# EAGLE design counter (EAGLE 8.3.2)
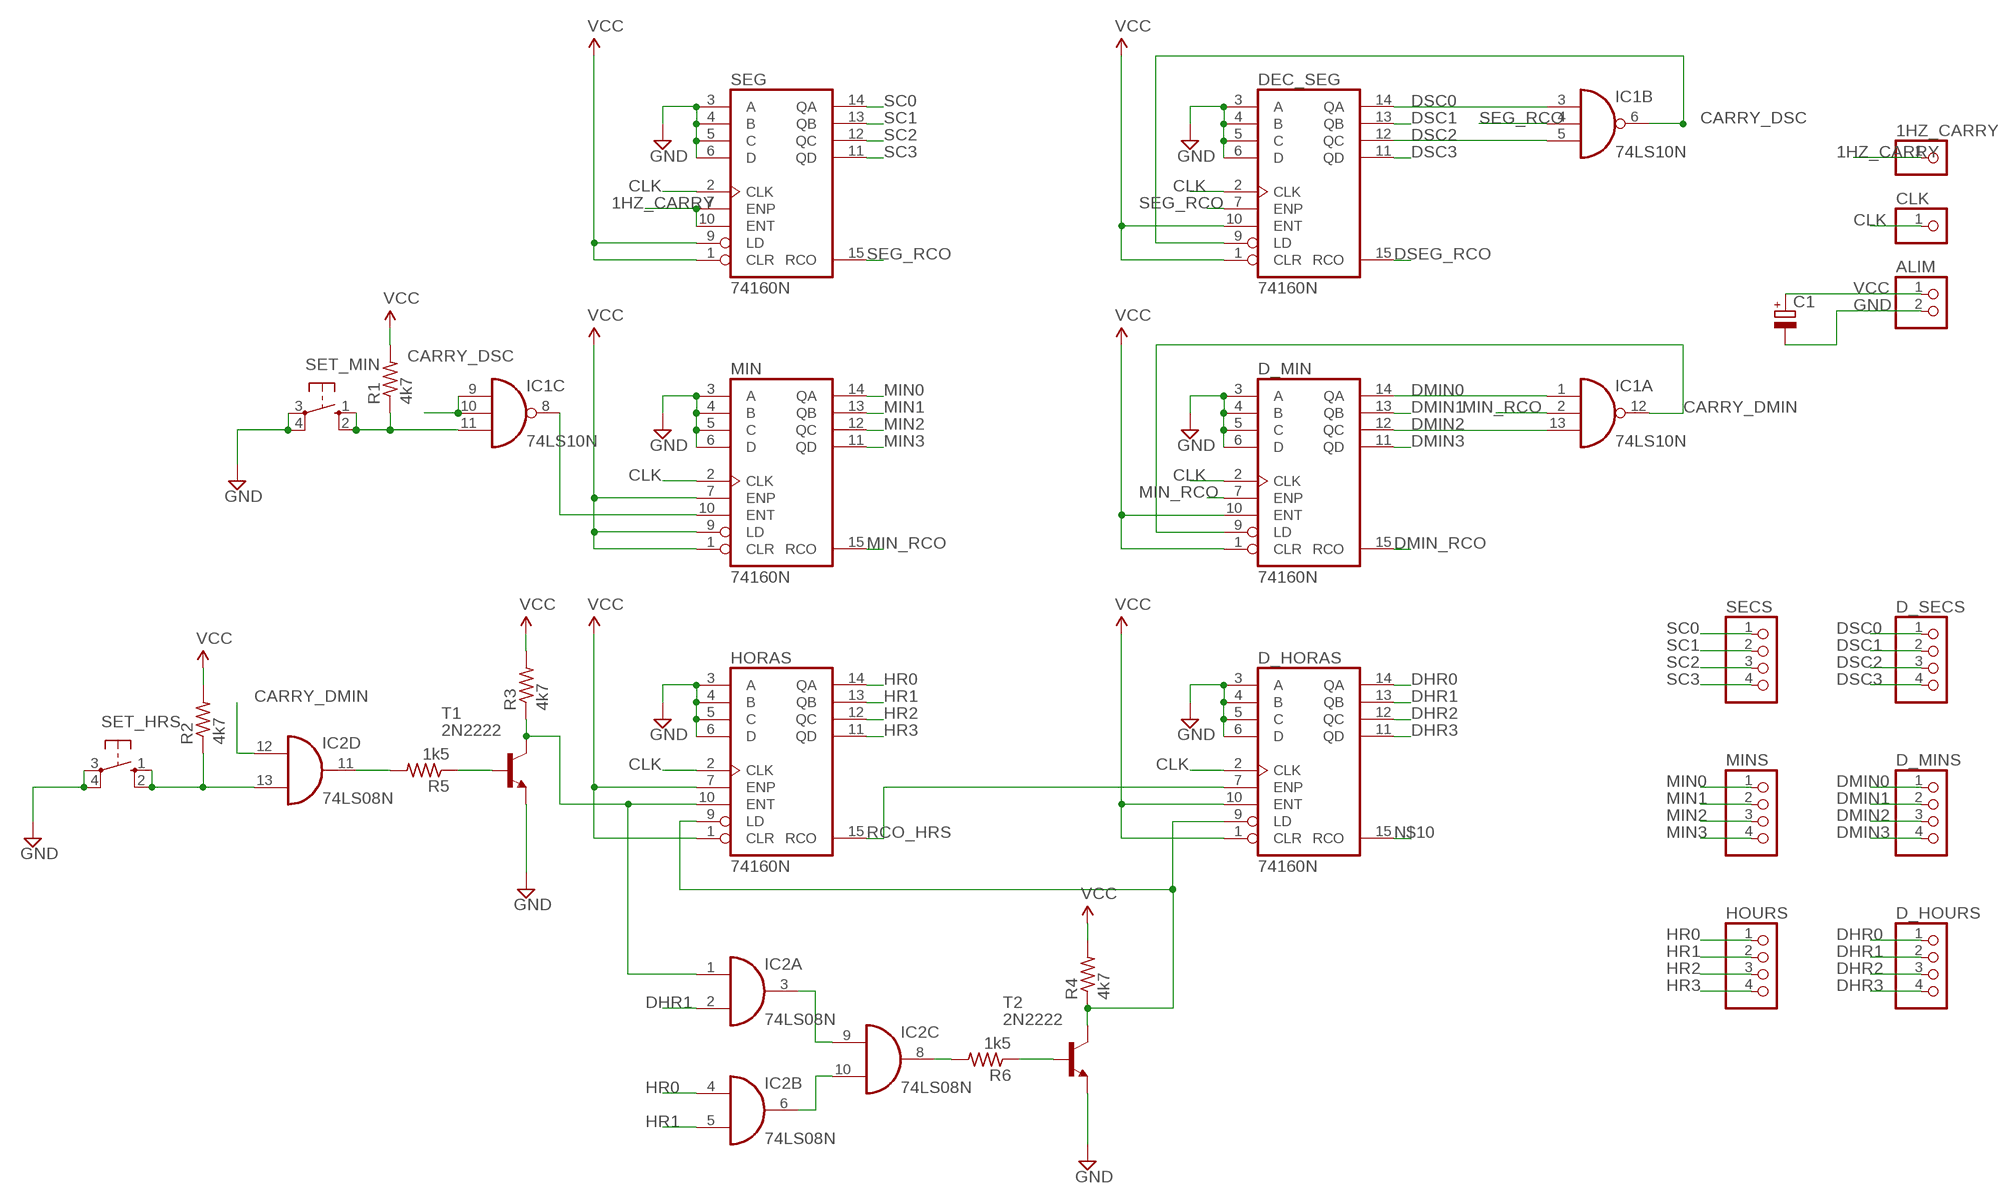
[diagram p0: schematic, sheet 1]

## Parts
1HZ_CARRY  PINHD-1X1  [1X01]
ALIM  PINHD-1X2  [1X02]
C1  CPOL-EUE2-5  [E2-5]
CLK  PINHD-1X1  [1X01]
D_HORAS  74160N  [DIL16]
D_HOURS  PINHD-1X4  [1X04]
D_MIN  74160N  [DIL16]
D_MINS  PINHD-1X4  [1X04]
D_SECS  PINHD-1X4  [1X04]
DEC_SEG  74160N  [DIL16]
HORAS  74160N  [DIL16]
HOURS  PINHD-1X4  [1X04]
IC1  74LS10N  [DIL14]
IC2  74LS08N  [DIL14]
MIN  74160N  [DIL16]
MINS  PINHD-1X4  [1X04]
R1  4k7  R-US_0204/7  [0204/7]
R2  4k7  R-US_0204/7  [0204/7]
R3  4k7  R-US_0204/7  [0204/7]
R4  4k7  R-US_0204/7  [0204/7]
R5  1k5  R-US_0204/7  [0204/7]
R6  1k5  R-US_0204/7  [0204/7]
SECS  PINHD-1X4  [1X04]
SEG  74160N  [DIL16]
SET_HRS  40-XX  [B3F-40XX]
SET_MIN  40-XX  [B3F-40XX]
T1  2N2222  [TO92-EBC-OVAL]
T2  2N2222  [TO92-EBC-OVAL]

## Nets
1HZ_CARRY: 1HZ_CARRY.1 SEG.7(ENP) SEG.10(ENT)
CARRY_DMIN: D_MIN.9(LD) IC1.12(A:O) IC2.12(D:I0)
CARRY_DSC: DEC_SEG.9(LD) IC1.6(B:O) IC1.9(C:I0) IC1.10(C:I1)
CLK: CLK.1 D_HORAS.2(CLK) D_MIN.2(CLK) DEC_SEG.2(CLK) HORAS.2(CLK) MIN.2(CLK) SEG.2(CLK)
DHR0: D_HORAS.14(QA) D_HOURS.1
DHR1: D_HORAS.13(QB) D_HOURS.2 IC2.2(A:I1)
DHR2: D_HORAS.12(QC) D_HOURS.3
DHR3: D_HORAS.11(QD) D_HOURS.4
DMIN0: D_MIN.14(QA) D_MINS.1 IC1.1(A:I0)
DMIN1: D_MIN.13(QB) D_MINS.2
DMIN2: D_MIN.12(QC) D_MINS.3 IC1.13(A:I2)
DMIN3: D_MIN.11(QD) D_MINS.4
DMIN_RCO: D_MIN.15(RCO)
DSC0: D_SECS.1 DEC_SEG.14(QA) IC1.3(B:I0)
DSC1: D_SECS.2 DEC_SEG.13(QB)
DSC2: D_SECS.3 DEC_SEG.12(QC) IC1.5(B:I2)
DSC3: D_SECS.4 DEC_SEG.11(QD)
DSEG_RCO: DEC_SEG.15(RCO)
GND: ALIM.2 C1.- D_HORAS.3(A) D_HORAS.4(B) D_HORAS.5(C) D_HORAS.6(D) D_MIN.3(A) D_MIN.4(B) D_MIN.5(C) D_MIN.6(D) DEC_SEG.3(A) DEC_SEG.4(B) DEC_SEG.5(C) DEC_SEG.6(D) HORAS.3(A) HORAS.4(B) HORAS.5(C) HORAS.6(D) MIN.3(A) MIN.4(B) MIN.5(C) MIN.6(D) SEG.3(A) SEG.4(B) SEG.5(C) SEG.6(D) SET_HRS.3(P) SET_HRS.4(P1) SET_MIN.3(P) SET_MIN.4(P1) T1.E T2.E
HR0: HORAS.14(QA) HOURS.1 IC2.4(B:I0)
HR1: HORAS.13(QB) HOURS.2 IC2.5(B:I1)
HR2: HORAS.12(QC) HOURS.3
HR3: HORAS.11(QD) HOURS.4
MIN0: MIN.14(QA) MINS.1
MIN1: MIN.13(QB) MINS.2
MIN2: MIN.12(QC) MINS.3
MIN3: MIN.11(QD) MINS.4
MIN_RCO: D_MIN.7(ENP) IC1.2(A:I1) MIN.15(RCO)
N$1: IC1.11(C:I2) R1.1 SET_MIN.1(S) SET_MIN.2(S1)
N$2: IC2.11(D:O) R5.2
N$3: R5.1 T1.B
N$4: IC2.6(B:O) IC2.10(C:I1)
N$5: IC2.13(D:I1) R2.1 SET_HRS.1(S) SET_HRS.2(S1)
N$6: IC2.3(A:O) IC2.9(C:I0)
N$7: IC2.8(C:O) R6.2
N$8: IC1.8(C:O) MIN.10(ENT)
N$9: HORAS.10(ENT) IC2.1(A:I0) R3.1 T1.C
N$10: D_HORAS.15(RCO)
N$11: R6.1 T2.B
N$13: D_HORAS.9(LD) HORAS.9(LD) R4.1 T2.C
RCO_HRS: D_HORAS.7(ENP) HORAS.15(RCO)
SC0: SECS.1 SEG.14(QA)
SC1: SECS.2 SEG.13(QB)
SC2: SECS.3 SEG.12(QC)
SC3: SECS.4 SEG.11(QD)
SEG_RCO: DEC_SEG.7(ENP) IC1.4(B:I1) SEG.15(RCO)
VCC: ALIM.1 C1.+ D_HORAS.1(CLR) D_HORAS.10(ENT) D_MIN.1(CLR) D_MIN.10(ENT) DEC_SEG.1(CLR) DEC_SEG.10(ENT) HORAS.1(CLR) HORAS.7(ENP) MIN.1(CLR) MIN.7(ENP) MIN.9(LD) R1.2 R2.2 R3.2 R4.2 SEG.1(CLR) SEG.9(LD)

## Power pins joined to a net without a drawn wire
GND: D_HORAS.8(GND) D_MIN.8(GND) DEC_SEG.8(GND) HORAS.8(GND) IC1.7(P:GND) IC2.7(P:GND) MIN.8(GND) SEG.8(GND)
VCC: D_HORAS.16(VCC) D_MIN.16(VCC) DEC_SEG.16(VCC) HORAS.16(VCC) IC1.14(P:VCC) IC2.14(P:VCC) MIN.16(VCC) SEG.16(VCC)

## Library data of the parts
1HZ_CARRY CLK = pinhead:PINHD-1X1: PIN HEADER
ALIM = pinhead:PINHD-1X2: PIN HEADER
C1 = rcl:CPOL-EU: POLARIZED CAPACITOR, European symbol
D_HORAS D_MIN DEC_SEG HORAS MIN SEG = 74xx-eu:74*160: Synchronous 4-bit COUNTER
D_HOURS D_MINS D_SECS HOURS MINS SECS = pinhead:PINHD-1X4: PIN HEADER
IC1 = 74xx-eu:74*10: Triple 3-input NAND gate
IC2 = 74xx-eu:74*08: Quad 2-input AND gate
R1-R6 = adafruit:R-US_: RESISTOR, American symbol
SET_HRS SET_MIN = adafruit:40-XX: OMRON SWITCH; MF: OMRON COMPONENTS USA; MPN: B3F-4000; OC_FARNELL: 176434; OC_NEWARK: 36K3105
T1 T2 = adafruit:2N2222: NPN TRANSISTOR Big oval pads

## Board
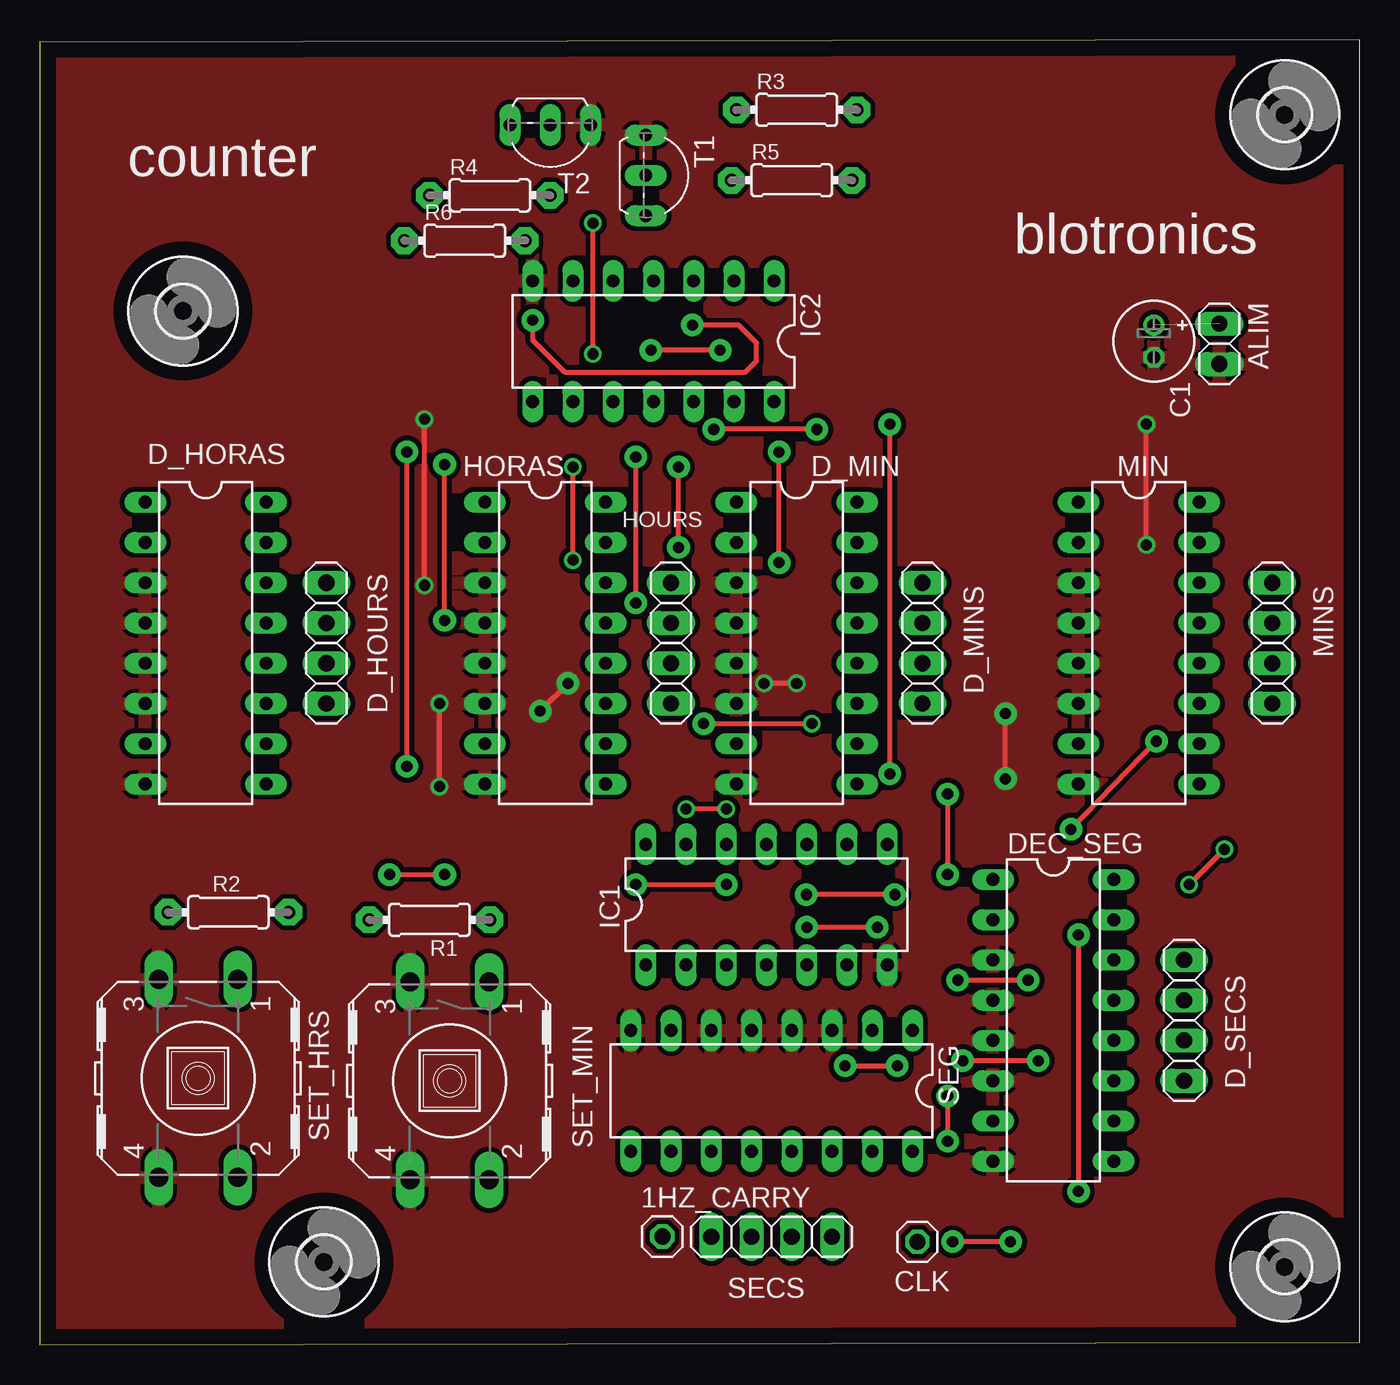
[diagram p1: board, top side]
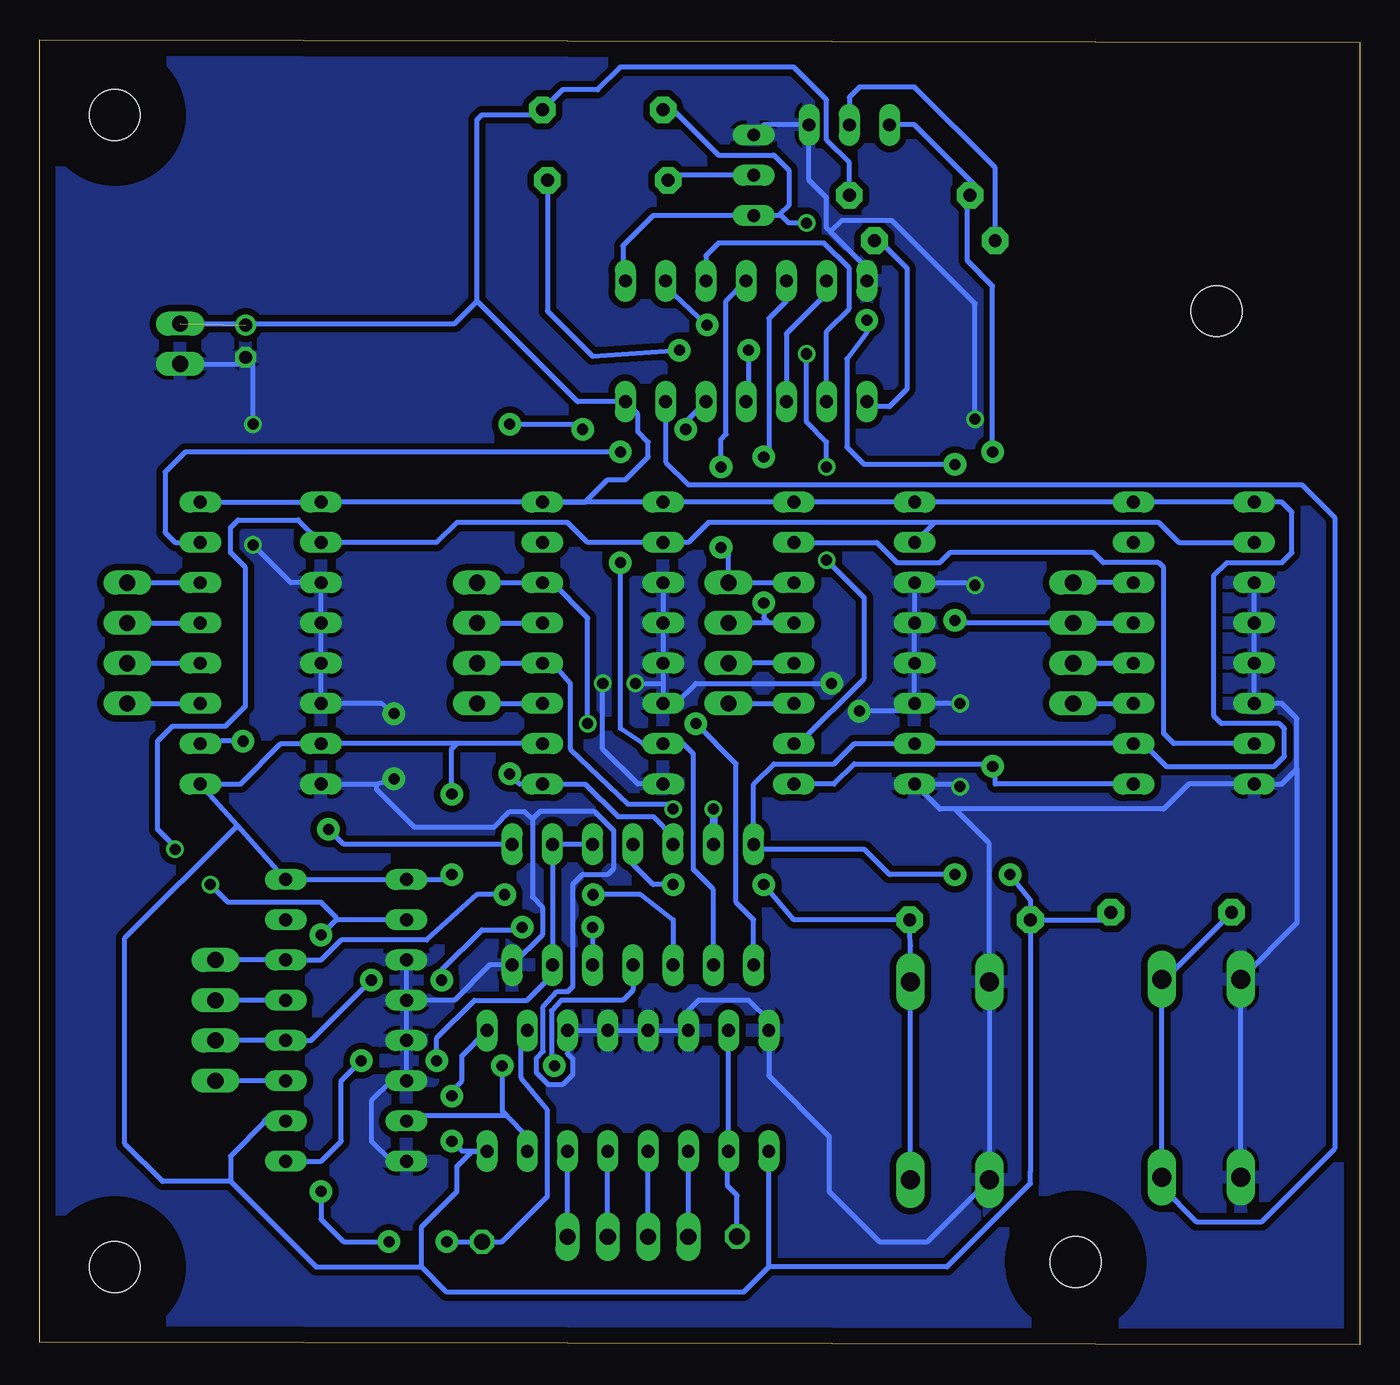
[diagram p2: board, bottom side, seen from below]

Size 83.32 x 82.38 mm. Coordinates in mm from the lower left corner, seen from the top.
Outline: 0,0 83.32,0.16 83.32,82.38 0,82.22 0,0
Copper layers (1*16): Top 0.035mm / dielectric 1.5mm / Bottom 0.035mm
Design rules "default": minimum track width 10mil, minimum drill 24mil, track to track 8mil, track to pad 8mil, pad to pad 8mil, via to via 8mil, smd to smd 8mil, copper to edge 40mil, drill to drill 8mil, minimum pad ring 10mil, minimum via ring 8mil, stop-mask expansion 4mil, vias tented up to drill 0mil, thermal gap 10mil

### Footprints (pad centres in the part's own frame; a part is rotated, then mirrored left to right if it is on the bottom)
1X01 = drill 1.016 octagon: 1 0,0
1X02 = drill 1.016 long: 1 -1.27,0; 2 1.27,0
E2-5 = drill 0.813 pad 1.27: + -1.016,0 | drill 0.813 pad 1.27 octagon: - 1.016,0
DIL16 = drill 0.813 long: 1 -8.89,-3.81; 2 -6.35,-3.81; 3 -3.81,-3.81; 4 -1.27,-3.81; 5 1.27,-3.81; 6 3.81,-3.81; 7 6.35,-3.81; 8 8.89,-3.81; 9 8.89,3.81; 10 6.35,3.81; 11 3.81,3.81; 12 1.27,3.81; 13 -1.27,3.81; 14 -3.81,3.81; 15 -6.35,3.81; 16 -8.89,3.81
1X04 = drill 1.016 long: 1 -3.81,0; 2 -1.27,0; 3 1.27,0; 4 3.81,0
DIL14 = drill 0.813 long: 1 -7.62,-3.81; 2 -5.08,-3.81; 3 -2.54,-3.81; 4 0,-3.81; 5 2.54,-3.81; 6 5.08,-3.81; 7 7.62,-3.81; 8 7.62,3.81; 9 5.08,3.81; 10 2.54,3.81; 11 0,3.81; 12 -2.54,3.81; 13 -5.08,3.81; 14 -7.62,3.81
0204/7 = drill 0.813 pad 1.676 octagon: 1 -3.81,0; 2 3.81,0
B3F-40XX = drill 1.194 long: 1 -6.248,2.489; 2 6.248,2.489; 3 -6.248,-2.489; 4 6.248,-2.489
TO92-EBC-OVAL = drill 0.813 long: B 0,-1.27; C 2.54,-1.27; E -2.54,-1.27
3,2 = hole 3.2: 0,0

### Placement (x,y rotation side)
1HZ_CARRY  39.3,6.84 0 top
ALIM  74.45,63.18 270 top
C1  70.33,63.34 270 top
CLK  55.4,6.51 90 top
D_HORAS  10.48,44.29 270 top
D_HOURS  18.1,44.29 270 top
D_MIN  47.78,44.29 270 top
D_MINS  55.72,44.29 270 top
D_SECS  72.23,20.48 270 top
DEC_SEG  63.98,20.48 270 top
HORAS  31.91,44.29 270 top
HOURS  39.85,44.29 270 top
IC1  45.88,27.78 0 top
IC2  38.74,63.34 180 top
MIN  69.37,44.29 270 top
MINS  77.79,44.29 270 top
R1  24.61,26.83 180 top
R2  11.91,27.31 0 top
R3  47.78,77.95 0 top
R4  28.42,72.55 0 top
R5  47.47,73.5 0 top
R6  26.83,69.69 0 top
SECS  46.2,6.83 180 top
SEG  46.2,16.03 180 top
SET_HRS  10,16.83 270 top
SET_MIN  25.88,16.67 270 top
T1  39.53,73.82 270 top
T2  32.23,75.72 180 top
U$1  [3,2]  78.58,4.92 0 top
U$2  [3,2]  17.94,5.24 0 top
U$3  [3,2]  9.05,65.25 0 top
U$4  [3,2]  78.58,77.63 0 top

### Tracks (layer width: path | path; a pad name or v marks a point on that pad's centre or on a via)
1HZ_CARRY
  Bottom 0.305: 1HZ_CARRY.1 39.3,9.43 39.91,10.04 39.91,12.16 SEG.10 SEG.7
CARRY_DMIN  (via drill 0.7 pad 1.42)
  Top 0.305: v53.66,36.04 v53.66,58.1 | v49.05,57.78 v42.54,57.78
  Bottom 0.305: IC1.12 43.34,32.07 44.61,33.34 46.83,33.34 48.89,35.4 D_MIN.9 53.02,35.4 v53.66,36.04 | v53.66,58.1 49.37,58.1 v49.05,57.78 | v42.54,57.78 42.54,58.26 IC2.12
CARRY_DSC  (via drill 0.7 pad 1.42)
  Top 0.305: v63.02,17.94 v58.26,17.94
  Bottom 0.305: IC1.10 IC1.9 IC1.6 50.96,23.34 52.55,21.75 55.88,21.75 58.26,19.37 v58.26,17.94 | DEC_SEG.9 65.56,11.59 64.29,12.86 64.29,16.67 v63.02,17.94
CLK  (via drill 0.7 pad 1.02, 0.7 pad 1.42)
  Top 0.305: v65.56,25.88 v65.56,9.68 | v61.28,6.51 v57.63,6.51 | v72.55,29.05 v74.77,31.27
  Bottom 0.305: 26.83,51.91 12.7,51.91 11.43,50.64 D_HORAS.2 | 26.83,51.91 HORAS.2 | 26.83,51.91 41.12,51.91 42.39,50.64 D_MIN.2 48.74,50.64 50.01,51.91 56.99,51.91 58.26,50.64 MIN.2 66.99,52.07 70.8,52.07 71.28,51.59 71.28,50.01 70.33,49.05 70.33,40.32 71.6,39.05 74.93,39.05 75.88,38.1 75.88,32.54 74.77,31.43 v74.77,31.27 | DEC_SEG.2 64.61,26.83 | 64.61,26.83 v65.56,25.88 | v65.56,9.68 65.56,7.94 64.13,6.51 v61.28,6.51 | v57.63,6.51 CLK.1 54.13,6.51 51.28,9.37 51.28,14.83 52.93,16.86 52.93,19.46 SEG.2 | 64.61,26.83 64.61,26.99 65.56,27.94 71.44,27.94 v72.55,29.05
DHR0
  Bottom 0.305: D_HORAS.14 D_HOURS.1
DHR1  (via drill 0.7 pad 1.42)
  Top 0.305: 31.43,64.29 v31.12,64.67 31.12,63.4 33.13,61.4 44.56,61.4 45.24,62.08 45.24,63.23 44.1,64.37 v41.2,64.37 | v25.56,45.72 v25.56,55.56
  Bottom 0.305: D_HORAS.13 D_HOURS.2 25.4,45.56 v25.56,45.72 | IC2.2 43.81,66.83 v41.2,64.37 | v31.12,64.67 31.12,63.87 32.38,62.23 32.38,56.67 31.27,55.56 v25.56,55.56
DHR2
  Bottom 0.305: D_HOURS.3 D_HORAS.12
DHR3
  Bottom 0.305: D_HOURS.4 D_HORAS.11
DMIN0  (via drill 0.7 pad 0.81, 0.7 pad 1.42)
  Top 0.305: v41.91,39.21 v48.74,39.21
  Bottom 0.305: D_MINS.1 D_MIN.14 50.96,48.1 48.74,45.88 v48.74,39.21 | IC1.1 38.26,26.83 39.37,27.94 39.37,36.67 v41.91,39.21
DMIN1
  Bottom 0.305: D_MINS.2 D_MIN.13
DMIN2  (via drill 0.7 pad 0.81)
  Top 0.305: v43.34,33.81 v40.8,33.81
  Bottom 0.305: D_MINS.3 D_MIN.12 | 50.96,43.02 49.85,41.75 49.85,37.62 46.2,34.13 43.66,34.13 v43.34,33.81
  Bottom 0.508: D_MIN.12 50.96,43.02 | v40.8,33.81 IC1.13
DMIN3
  Bottom 0.305: D_MINS.4 D_MIN.11
DSC0  (via drill 0.7 pad 1.42)
  Top 0.305: v53.97,28.42 v48.39,28.42
  Bottom 0.305: D_SECS.1 DEC_SEG.14 65.56,24.29 64.29,25.56 58.9,25.56 55.72,28.42 v53.97,28.42 | IC1.3 43.34,26.83 45.4,28.42 v48.39,28.42
DSC1
  Bottom 0.305: DEC_SEG.13 D_SECS.2
DSC2  (via drill 0.7 pad 1.42)
  Top 0.305: v62.39,23.02 v57.94,23.02 | v52.86,26.35 v48.42,26.35
  Bottom 0.305: D_SECS.3 DEC_SEG.12 66.2,19.21 v62.39,23.02 | v57.94,23.02 57.94,23.65 55.4,26.19 52.86,26.19 | v48.42,26.35 IC1.5
  Bottom 0.508: 52.86,26.19 v52.86,26.35
DSC3
  Bottom 0.305: DEC_SEG.11 D_SECS.4
GND  (via drill 0.7 pad 1.02, 0.7 pad 1.42)
  Top 0.305: v60.96,35.72 v60.96,39.85 | v33.34,41.75 v31.59,40 | v47.78,41.75 v45.72,41.75 | v25.24,35.24 v25.24,40.48 | v24.29,47.94 v24.29,58.42 | v69.85,50.48 v69.85,58.1
  Bottom 0.305: D_MIN.3 D_MIN.4 D_MIN.5 43.97,41.75 | 43.97,41.75 D_MIN.6 43.18,40.48 41.91,41.75 v33.34,41.75 | D_HORAS.3 D_HORAS.4 D_HORAS.5 D_HORAS.6 4.92,40.48 3.97,39.53 3.97,36.35 | 25.56,33.81 12.38,33.81 10.79,35.4 D_HORAS.8 4.92,35.4 3.97,36.35 | 25.56,33.81 26.51,33.81 HORAS.8 25.4,35.4 v25.24,35.24 | HORAS.6 HORAS.5 HORAS.4 HORAS.3 24.45,48.1 v24.29,47.94 | T1.E 37.62,76.99 T2.E 34.77,73.5 33.65,72.39 33.65,70.48 33.42,70.25 | MIN.8 62.07,35.4 | 62.07,35.4 v60.96,35.72 | v60.96,39.85 61.75,40.48 MIN.6 MIN.5 MIN.4 MIN.3 67.47,48.1 v69.85,50.48 | 61.12,11.59 62.39,12.86 62.39,15.4 61.12,16.67 DEC_SEG.6 DEC_SEG.5 DEC_SEG.4 | DEC_SEG.4 DEC_SEG.3 | 25.56,33.81 23.39,31.64 SET_MIN.3 SET_MIN.4 27.3,6.51 30.32,6.51 33.5,9.68 33.5,13.18 37.31,16.99 SEG.8 37.31,20.48 38.58,21.75 41.75,21.75 42.39,21.11 SEG.6 SEG.5 SEG.4 SEG.3 50.01,18.38 49.69,18.07 49.69,17.05 50.32,16.41 51.21,16.41 51.97,17.18 51.97,18.09 51.54,18.52 51.54,21.34 50.65,22.31 49.97,22.31 49.66,22.61 49.66,29.09 49.05,29.7 47.45,29.7 47.07,30.08 47.07,32.44 48.29,33.66 51.75,33.66 52.23,33.18 | IC2.7 31.11,68.1 31.27,68.1 33.42,70.25 | D_MIN.8 45.56,35.4 47.78,37.62 v47.78,41.75 | v45.72,41.75 43.97,41.75 | v25.24,40.48 HORAS.6 | HORAS.6 28.26,40.48 28.73,40 v31.59,40 | v24.29,58.42 24.29,65.72 29.53,70.96 32.7,70.96 33.42,70.25 | SET_HRS.4 SET_HRS.3 3.97,26.62 3.97,36.35 | v69.85,58.1 69.85,61.85 C1.- 70.74,61.91 ALIM.2 | DEC_SEG.4 57.15,21.75 54.93,23.97 IC1.7 51.59,25.88 51.59,27.62 52.23,28.26 52.23,33.18 | 62.07,35.4 62.07,35.08 59.69,32.7 54.61,32.7 53.66,33.65 52.7,33.65 52.23,33.18
  Bottom 0.508: DEC_SEG.8 61.12,11.59
  pour Bottom (isolate 0.406): -13.81,82.96 -13.81,1.43 95.15,1.43 95.15,82.96
  pour Top (isolate 0.305): -6.95,86.01 -6.95,-2.38 86.77,-2.38 86.77,86.01
HR0  (via drill 0.7 pad 1.42)
  Top 0.305: v40.32,50.32 v40.32,55.4
  Bottom 0.305: HORAS.14 HOURS.1 39.85,49.85 v40.32,50.32 | v40.32,55.4 40.32,57.15 40,57.47 40,65.88 IC2.4
HR1  (via drill 0.7 pad 1.42)
  Top 0.305: v37.62,56.04 v37.62,46.83
  Bottom 0.305: HORAS.13 37.31,45.56 | 37.31,45.56 HOURS.2 | IC2.5 36.19,65.88 37.31,64.77 37.31,56.51 v37.62,56.04 | v37.62,46.83 37.62,45.88 37.31,45.56
HR2
  Bottom 0.305: HORAS.12 HOURS.3
HR3
  Bottom 0.305: HOURS.4 HORAS.11
MIN0
  Bottom 0.305: MINS.1 MIN.14
MIN1
  Bottom 0.305: MINS.2 MIN.13
MIN2
  Bottom 0.305: MINS.3 MIN.12
MIN3
  Bottom 0.305: MINS.4 MIN.11
MIN_RCO  (via drill 0.7 pad 1.42)
  Top 0.305: v46.67,49.37 v46.67,56.36
  Bottom 0.305: v46.67,49.37 46.67,38.89 45.24,37.94 D_MIN.7 42.7,37.94 42.07,37.31 42.07,30 40.8,28.73 IC1.2 | v46.67,56.36 74.14,56.36 75.41,55.09 75.41,51.28 74.77,50.64 MIN.15
N$1  (via drill 0.7 pad 1.42)
  Top 0.305: v37.62,29.05 v43.34,29.05
  Bottom 0.305: SET_MIN.2 SET_MIN.1 28.37,25.19 R1.1 35.72,26.83 v37.62,29.05 | v43.34,29.05 44.61,29.05 45.88,30.32 IC1.11
  Bottom 0.508: SET_MIN.1 28.37,23.07
N$2  (via drill 0.7 pad 1.42)
  Top 0.305: v42.95,62.77 v38.58,62.77
  Bottom 0.305: R5.2 51.28,65.25 48.42,62.39 v42.95,62.77 | v38.58,62.77 38.58,59.69 IC2.11
N$3
  Bottom 0.305: T1.B 43.34,73.82 R5.1
N$4
  Bottom 0.305: IC2.6 33.65,66.36 36.19,63.82 IC2.10
N$5
  Bottom 0.305: IC2.13 43.81,55.72 42.39,54.29 3.65,54.29 1.59,52.23 1.59,12.38 6.19,7.78 10.32,7.78 12.54,10 12.54,10.53 SET_HRS.2 SET_HRS.1 12.33,23.08 R2.1
N$6
  Bottom 0.305: IC2.9 33.65,63.98 32.23,65.4 32.23,67.94 33.81,69.53 40.48,69.53 41.27,68.74 IC2.3
N$7
  Bottom 0.305: R6.2 30.32,69.69 28.57,67.94 28.57,60.32 29.69,59.21 30.8,59.21 IC2.8
N$8  (via drill 0.7 pad 1.42)
  Top 0.305: v65.09,32.54 v70.48,38.1
  Bottom 0.305: IC1.8 64.13,31.59 v65.09,32.54 | v70.48,38.1 73.02,38.1 MIN.10
N$9  (via drill 0.7 pad 1.02)
  Top 0.305: v33.65,49.53 v33.65,55.4 | v34.92,62.55 v34.92,70.8
  Bottom 0.305: R3.1 43.34,77.95 40.48,75.09 36.99,75.09 36.04,74.14 36.04,71.91 36.59,71.36 | 36.59,71.36 36.67,71.28 T1.C 44.61,71.28 46.51,69.37 46.51,68.1 46.2,67.79 46.2,67.31 IC2.1 | 35.4,37.94 31.27,42.07 31.27,47.15 v33.65,49.53 | v33.65,55.4 33.65,56.99 34.92,58.26 v34.92,62.55 | v34.92,70.8 36.04,70.8 36.59,71.36
  Bottom 0.508: HORAS.10 35.4,37.94
N$11
  Bottom 0.305: R6.1 23.02,74.29 28.1,79.37 31.59,79.37 32.23,78.74 T2.B
N$13  (via drill 0.7 pad 1.42)
  Top 0.305: v23.18,36.51 v23.18,56.36
  Bottom 0.305: HORAS.9 33.18,35.4 31.91,36.67 23.34,36.67 v23.18,36.51 23.02,36.35 23.02,35.4 D_HORAS.9 | T2.C 28.1,76.99 24.29,73.18 R4.1 24.76,72.39 24.76,68.42 23.18,66.83 v23.18,56.36
RCO_HRS
  Bottom 0.305: D_HORAS.7 11.75,37.94 12.38,38.58 12.38,49.05 12.7,49.37 16.19,49.37 16.83,50.01 25.88,50.01 26.51,49.37 29.21,49.37 30.48,50.64 HORAS.15
SC0
  Bottom 0.305: SECS.1 SEG.14
SC1
  Bottom 0.305: SECS.2 SEG.13
SC2
  Bottom 0.305: SECS.3 SEG.12
SC3
  Bottom 0.305: SECS.4 SEG.11
SEG_RCO  (via drill 0.7 pad 1.42)
  Top 0.305: v50.83,17.62 v54.13,17.62
  Bottom 0.305: 52.55,13.18 53.82,14.45 | 53.82,14.45 59.85,14.45 DEC_SEG.7 | IC1.4 45.88,22.38 46.51,21.75 50.41,21.75 51.02,21.09 51.02,18.19 v50.83,17.62 | v54.13,17.62 54.13,14.76 53.82,14.45
  Bottom 0.508: SEG.15 52.55,13.18
VCC  (via drill 0.7 pad 1.42)  (1 unrouted)
  Top 0.305: v57.31,12.86 v57.31,15.72 | v22.08,29.69 v25.56,29.69 | v57.31,29.69 v57.31,34.77
  Bottom 0.305: D_MIN.16 D_MIN.1 HORAS.16 HORAS.1 D_HORAS.16 D_HORAS.1 4.92,53.18 4.29,52.55 4.29,50.01 4.92,49.37 8.41,49.37 9.21,48.58 9.21,39.69 8.73,39.21 5.08,39.21 4.76,38.89 4.76,37.15 5.4,36.51 12.22,36.51 13.65,37.94 D_HORAS.10 HORAS.7 31.91,37.94 33.18,36.67 36.99,36.67 38.26,35.4 IC1.14 | D_MIN.16 MIN.1 MIN.16 | 37.31,4.92 SEG.9 | 37.31,4.92 38.89,3.33 57.63,3.33 59.21,4.92 | 59.21,4.92 59.21,7.46 56.99,9.68 56.99,11.27 56.04,12.22 SEG.16 56.67,12.22 v57.31,12.86 | 69.06,14.13 71.28,11.91 71.28,10.32 | 71.28,10.32 65.88,4.92 59.21,4.92 | v57.31,15.72 57.31,16.03 56.67,16.67 56.67,18.26 SEG.1 | 70.84,32.78 DEC_SEG.16 DEC_SEG.1 57.63,29.37 | 70.84,32.78 MIN.9 70.64,35.4 68.1,37.94 MIN.7 56.99,37.94 | v22.08,29.69 20.8,28.1 R1.2 | v25.56,29.69 29.69,29.69 31.27,31.27 37.94,31.27 | D_MIN.10 56.99,37.94 | v57.31,34.77 57.31,37.62 56.99,37.94 | 71.28,10.32 75.56,10.32 77.95,12.7 77.95,25.67 70.84,32.78 | R1.2 20.8,10.95 20.78,10.94 20.78,10.19 26.05,4.92 37.31,4.92 | 55.72,65.88 49.37,59.53 IC2.14 45.56,58.74 45.56,57.63 44.93,56.99 44.93,56.04 46.35,54.61 47.47,54.61 48.89,53.18 D_MIN.16 | R4.2 32.23,74.61 33.65,76.04 33.65,78.58 35.72,80.64 46.67,80.64 48.1,79.22 50.32,79.22 R3.2 51.91,77.63 55.4,77.63 55.72,77.31 55.72,65.88 | R1.2 16.19,26.83 R2.2 | ALIM.1 57.15,64.45 55.72,65.88
  Bottom 0.508: DEC_SEG.10 69.06,14.13 | 37.94,31.27 IC1.14 | 57.63,29.37 v57.31,29.69

### Text on the board
tPlace: counter | blotronics